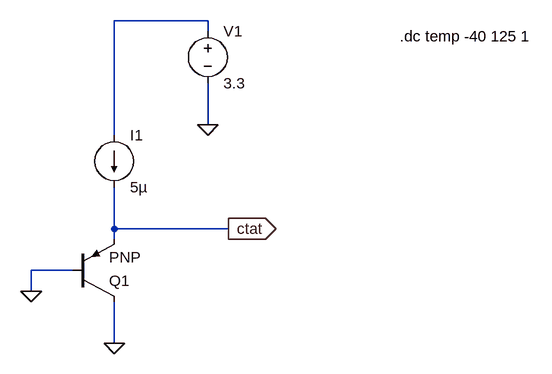
[diagram p0: schematic ctat.asc]
ctat.asc, the LTspice schematic file:
Version 4.1
SHEET 1 880 680
WIRE 352 -352 208 -352
WIRE 352 -336 352 -352
WIRE 352 -192 352 -256
WIRE 208 -176 208 -352
WIRE 208 -32 208 -96
WIRE 384 -32 208 -32
WIRE 208 -16 208 -32
WIRE 144 32 80 32
WIRE 80 64 80 32
WIRE 208 144 208 80
FLAG 208 144 0
FLAG 80 64 0
FLAG 352 -192 0
FLAG 384 -32 ctat
IOPIN 384 -32 Out
SYMBOL pnp 144 80 M180
SYMATTR InstName Q1
SYMBOL current 208 -176 R0
WINDOW 123 0 0 Left 0
WINDOW 39 0 0 Left 0
SYMATTR InstName I1
SYMATTR Value 5µ
SYMBOL voltage 352 -352 R0
WINDOW 123 0 0 Left 0
WINDOW 39 0 0 Left 0
SYMATTR InstName V1
SYMATTR Value 3.3
TEXT 648 -328 Left 2 !.dc temp -40 125 1

The netlist it stands for:
* ctat.asc
Q1 0 0 ctat 0 PNP
I1 N001 ctat 5µ
V1 N001 0 3.3
.model NPN NPN
.model PNP PNP
.lib standard.bjt
.dc temp -40 125 1
.backanno
.end